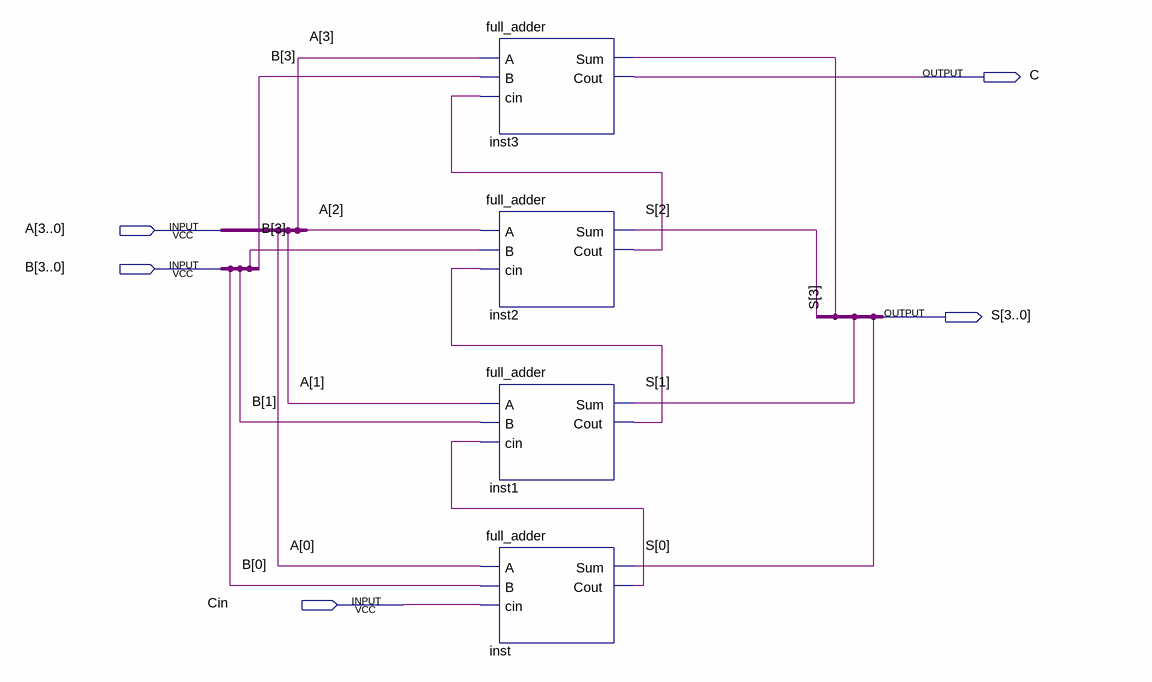
[diagram p0: schematic sheet]
// Quartus schematic full_adder_4b.bdf as structural Verilog: 4 symbols, 5 pins
module full_adder_4b (
  input  [3:0] A,
  input  [3:0] B,
  input  Cin,
  output C,
  output [3:0] S
);

  wire inst1_cout, inst2_cout, inst_cout;

  full_adder inst3 (.A(A[3]), .B(B[3]), .cin(inst2_cout), .Sum(S[3]), .Cout(C));
  full_adder inst2 (.A(A[2]), .B(B[3]), .cin(inst1_cout), .Sum(S[2]), .Cout(inst2_cout));
  full_adder inst1 (.A(A[1]), .B(B[1]), .cin(inst_cout), .Sum(S[1]), .Cout(inst1_cout));
  full_adder inst (.A(A[0]), .B(B[0]), .cin(Cin), .Sum(S[0]), .Cout(inst_cout));
endmodule
